# Altium schematic sheet pca64110.SchDoc: =BoardTitle
size A4; Organization: Nordic Semiconductor; SheetNumber: 1; SheetTotal: 1; CompanyName: Nordic Semiconductor; DocumentSize: A4
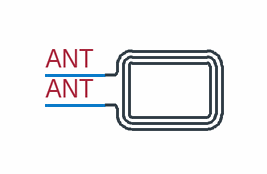
[diagram p0: pca64110.SchDoc]

## Parts
A1  NFC_ANT_Listener-6  [NFC_ANT_Listener-6]  (value not drawn)  (no BOM)

## Nets
ANT: A1.1 A1.2

## Notes on the sheet
- Title
- Size
- Date:
- File:
- A4
- PCB Assembly Number
- Sheet         of
- Drawn By:
- Revision
- Classification:

## Library data of the parts
A1 = NFC_ANT_Listener-6: NFC Antenna Listener-6; Manufacturer: N.A.; Pad Count: 2; Part Number: NFC_ANT_Listener-6; Manufacturer Part Number: N.A.; Footprint Doc: NFC_ANT_Listener-6; LatestRevisionDate: 2015-05-29; Published: 2015-05-29; Value: NFC_ANT_Listener-6; Note: N.A.; Artikkelnr Noca: N.A.; PartId: 100700008; Component Class: Antennas; Author: rsk; ComponentLink1URL: N.A.; ComponentLink1Description: Datasheet; ComponentLink2URL: N.A.; ComponentLink2Description: Supplier link; HelpURL: N.A.; Supplier 1: N.A.; Supplier Part Number 1: N.A.; Supplier 2: N.A.; Supplier Part Number 2: N.A.; Part number IPS: N.A.; Part number Norautron: N.A.